# Altium schematic sheet PWM-SOT23.SchDoc: =ProjectTitle
size 297 x 209 mm; Address1: Address1; Address2: Address2; Address3: Address3; Address4: Address4; SheetNumber: ?; SheetTotal: ?; Scale: 1:1; DocumentType: Схема электрическая принципиальная; Title2str: ?
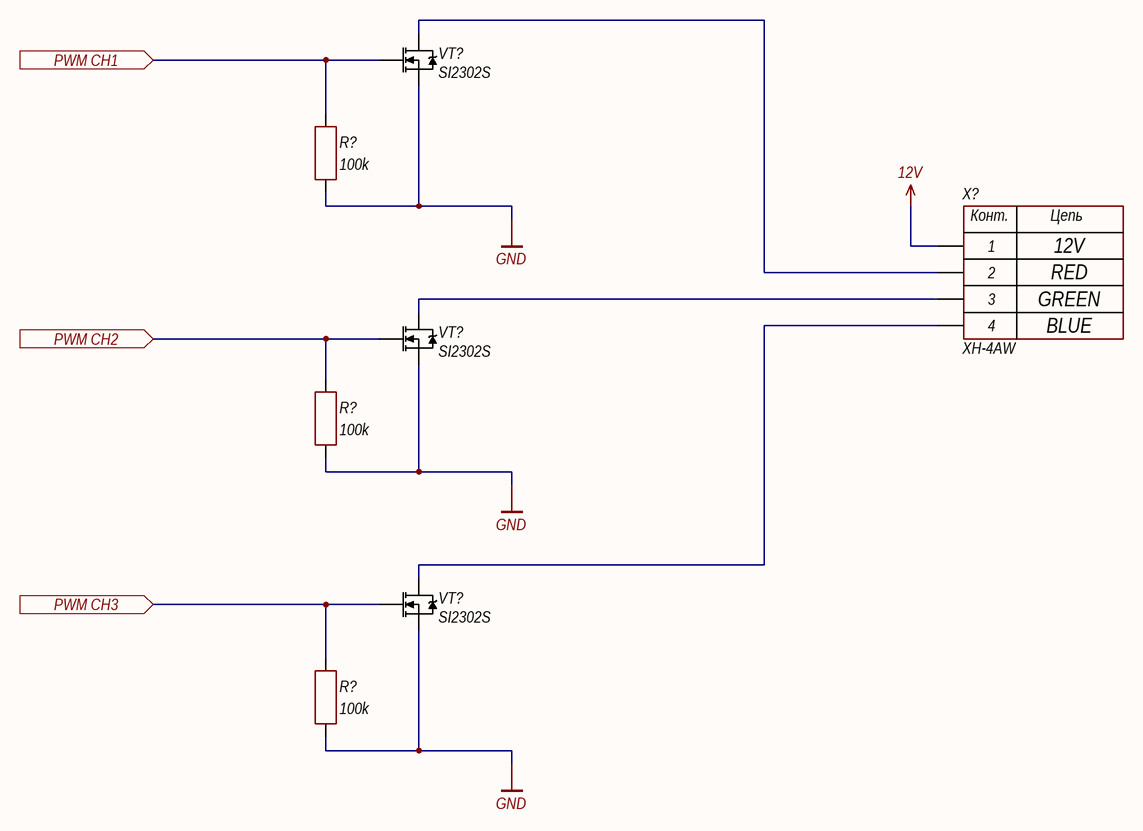
[diagram p0: PWM-SOT23.SchDoc]

## Parts
(Parts that share a designator on the sheet are numbered #1, #2 ... from top to bottom, then left to right.)
R?#1  100k  [CH0402R]
R?#2  100k  [CH0402R]
R?#3  100k  [CH0402R]
VT?#1  SI2302S  [SOT23_123]
VT?#2  SI2302S  [SOT23_123]
VT?#3  SI2302S  [SOT23_123]
X?  XH-4AW  [CON: XH-4AW]

## Ports
PWM CH1 (in), PWM CH2 (in), PWM CH3 (in)

## Nets
12V: X?.1
GND: R?#1.1 R?#2.1 R?#3.1 VT?#1.3(S) VT?#2.3(S) VT?#3.3(S)
PWM CH1: R?#1.2 VT?#1.1(G) ; port PWM CH1
PWM CH2: R?#2.2 VT?#2.1(G) ; port PWM CH2
PWM CH3: R?#3.2 VT?#3.1(G) ; port PWM CH3
NetVT?#1_2: VT?#1.2(D) X?.2
NetVT?#2_2: VT?#2.2(D) X?.3
NetVT?#3_2: VT?#3.2(D) X?.4

## Notes on the sheet
- 12V
- RED
- GREEN
- BLUE
- Изм.
- Лист
- № докум.
- Подп.
- Дата
- Копировал
- Формат А4
- (in symbol 4-Connector) Конт.; Цепь

## Library data of the parts
R?#1-R?#3 = Resistor: Manufacturer: Uniroyal Elec; Model: 0402WGF1003TCE; HelpURL: https://lcsc.com/product-detail/Chip-Resistor-Surface-Mount_UNI-ROYAL-Uniroyal-Elec-0402WGF1003TCE_C25741.html; ComponentKind: ±1%; Value: 100k
VT?#1-VT?#3 = N-chanel: Mosfet; Manufacturer: Microdiode Electronics; Model: SI2302S; ComponentKind: 20V, 2.3A, 1.5V; HelpURL: https://lcsc.com/product-detail/MOSFET_MDD-Microdiode-Electronics-SI2302S_C427388.html
X? = 4-Connector: Model: XH-4AW; Manufacturer: *; HelpURL: *; ComponentKind: *